# Altium project ECGAcquisitionSystem.PrjPcb
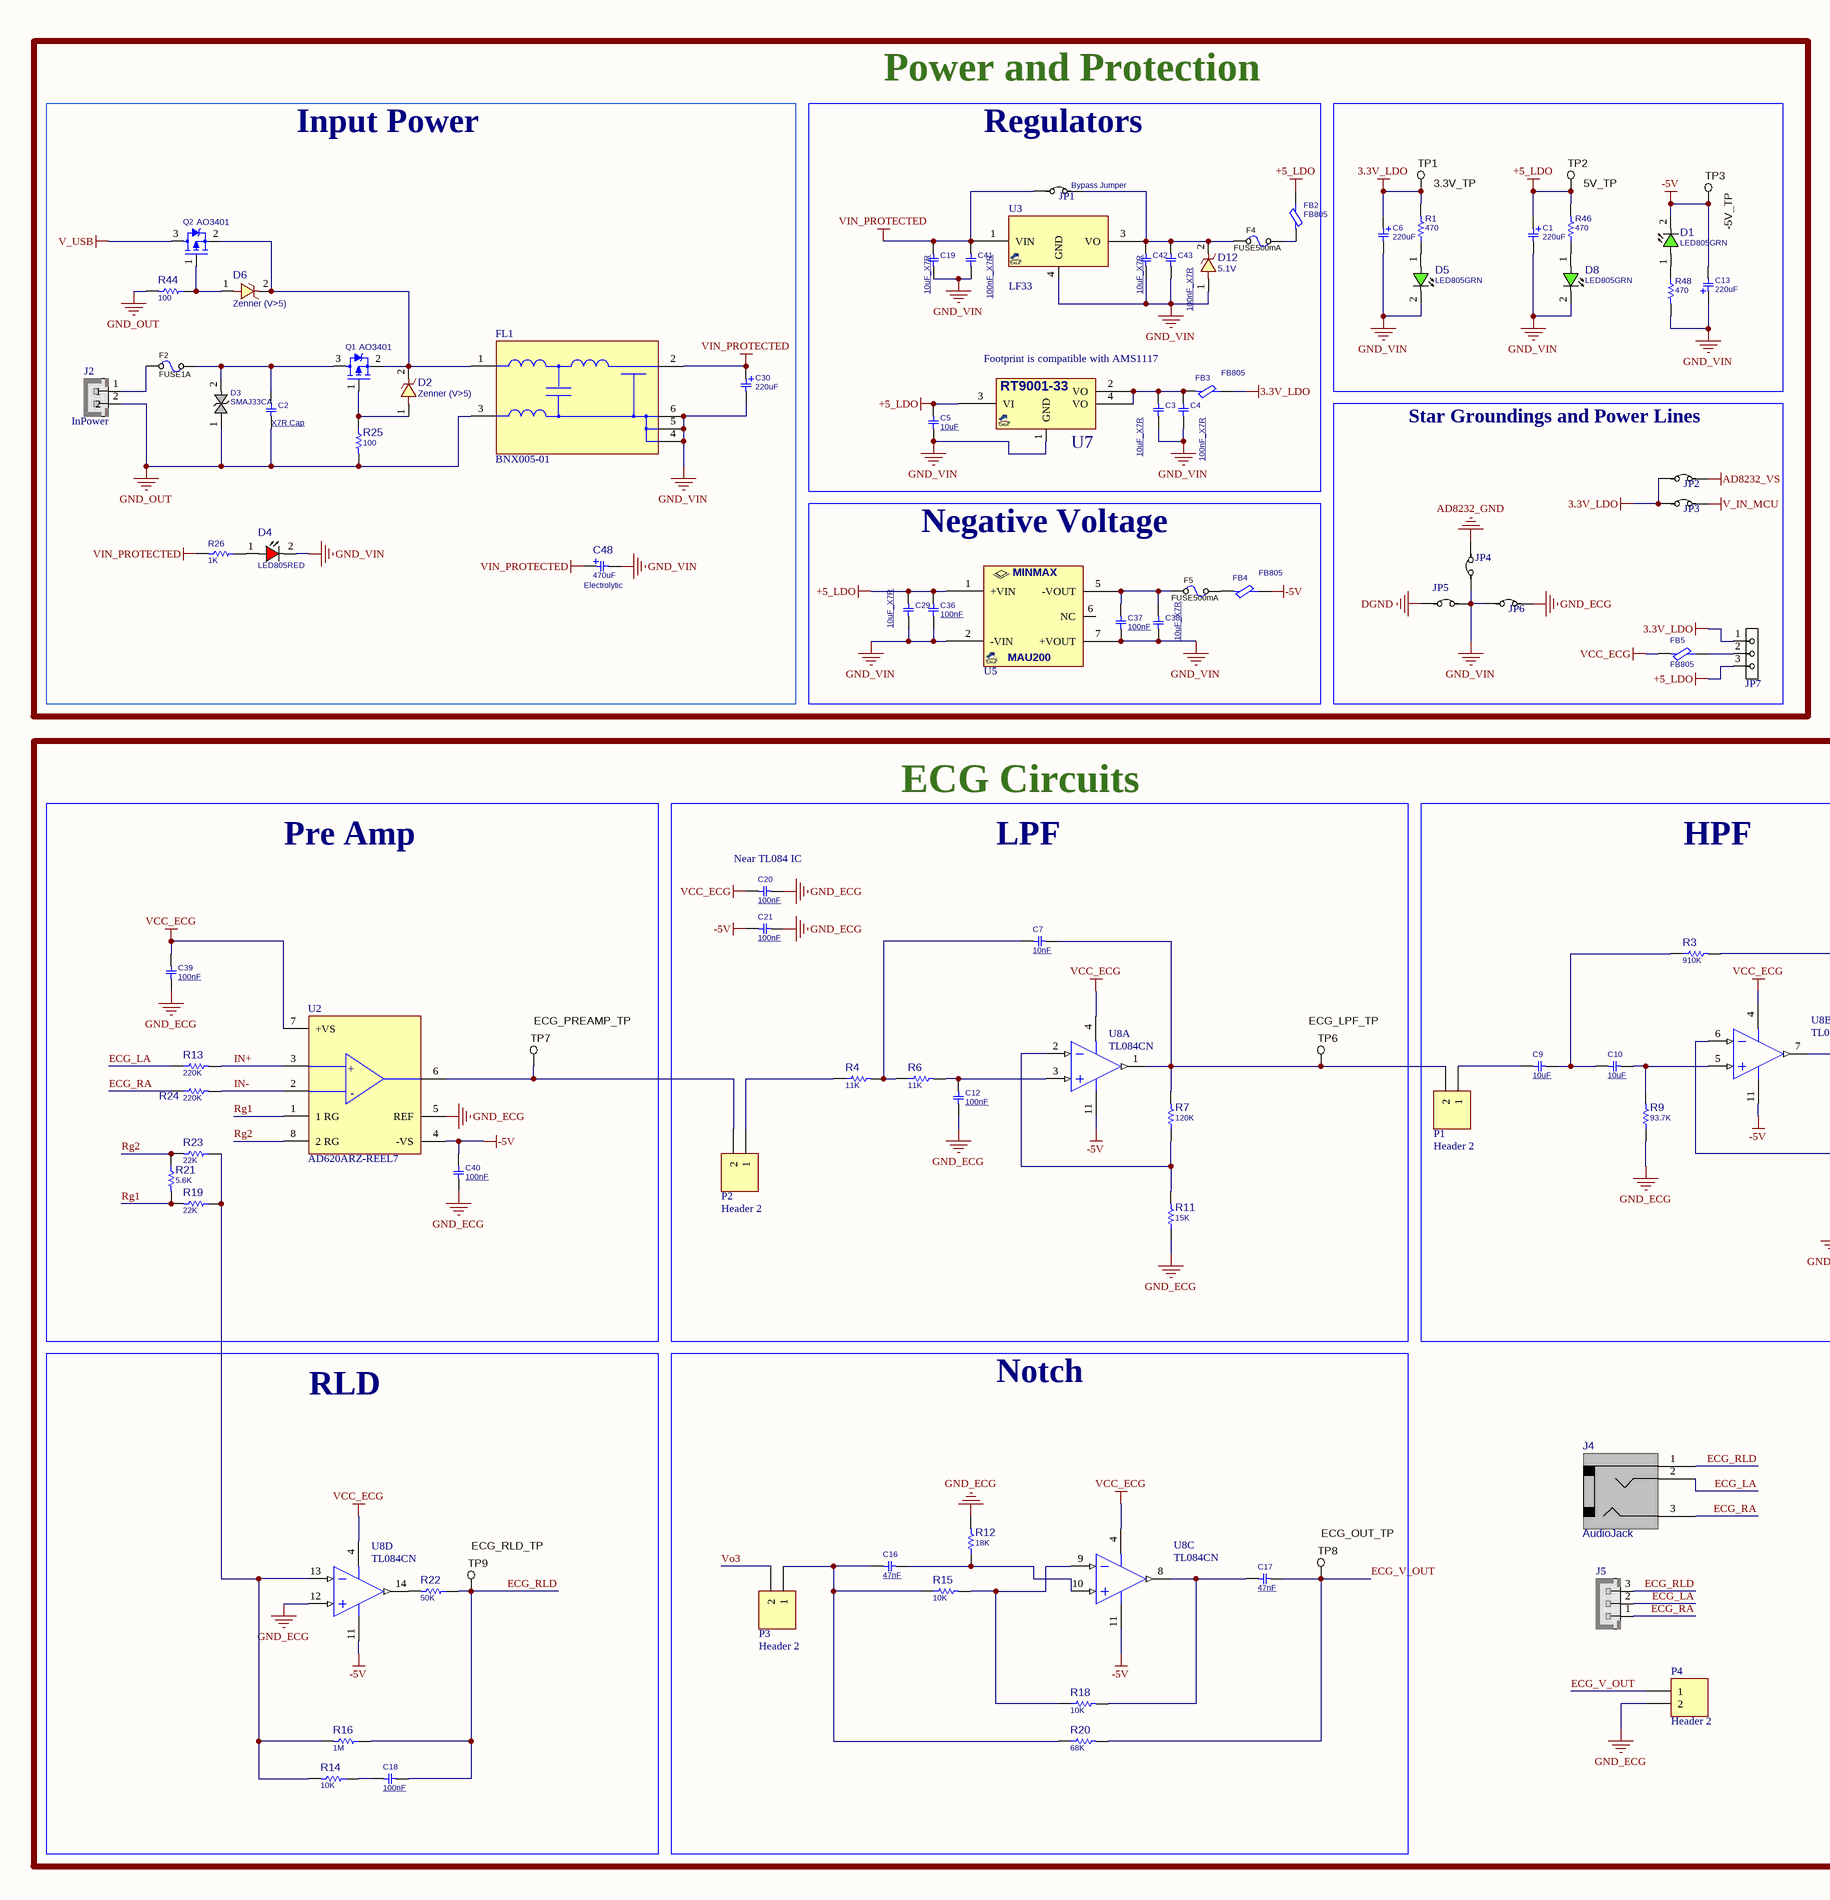
[diagram p0: Sch_ECGAcquisitionSystem.SchDoc, left]
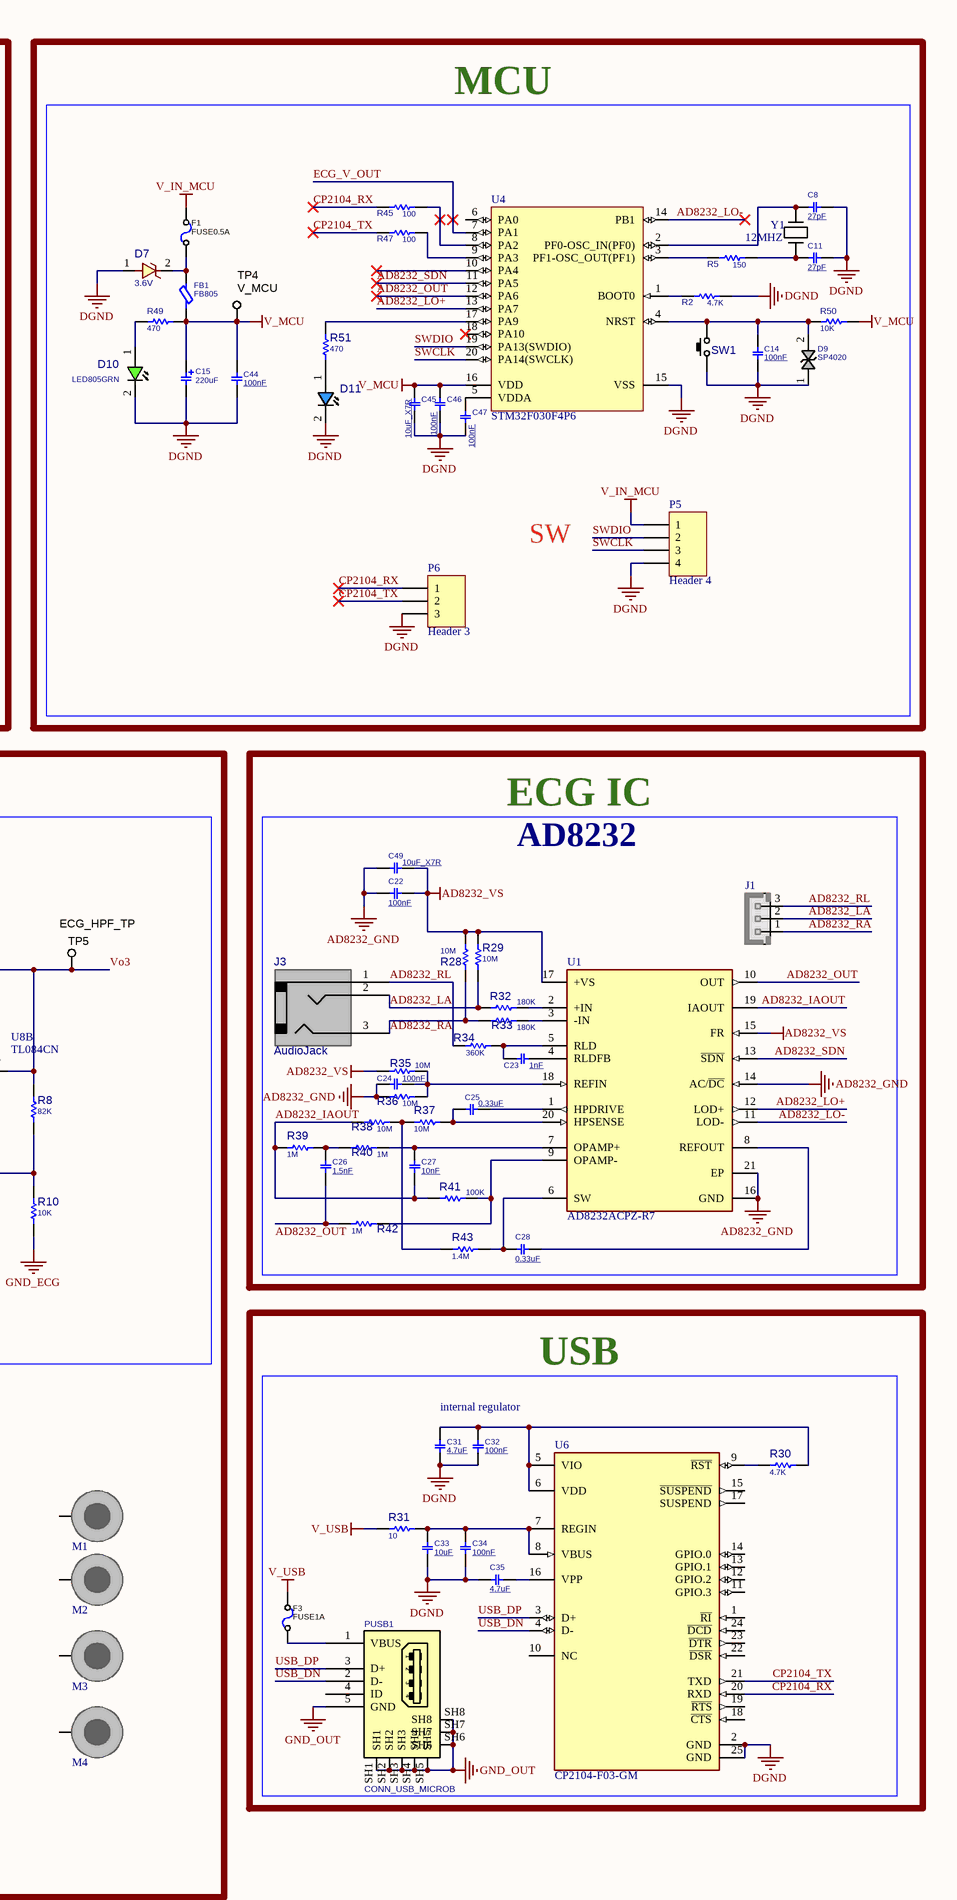
[diagram p1: Sch_ECGAcquisitionSystem.SchDoc, right]
1 sheet, 165 parts. Net scope: global (net labels, ports and power ports of the same name join across sheets).
Board file: PCB_ECGAcquisitionSystem.PcbDoc

## Sheet Sch_ECGAcquisitionSystem.SchDoc: ECG Acquisition Board
size A2; Date: Jan 2024; Engineer: Ali Hashemi; Revision: 1; SheetNumber: 1; SheetTotal: 1

### Parts
C1  220uF  [C_TN_7343]
C2  X7R Cap  [C0805S]
C3  10uF_X7R  [C0805S]
C4  100nF_X7R  [C0805S]
C5  10uF  [C0805S]
C6  220uF  [C_TN_7343]
C7  10nF  [C0805S]
C8  27pF  [C0805]
C9  10uF  [C0805S]
C10  10uF  [C0805S]
C11  27pF  [C0805]
C12  100nF  [C0805S]
C13  220uF  [C_TN_7343]
C14  100nF  [C0805S]
C15  220uF  [C_TN_7343]
C16  47nF  [C0805S]
C17  47nF  [C0805S]
C18  100nF  [C0805S]
C19  10uF_X7R  [C0805S]
C20  100nF  [C0805S]
C21  100nF  [C0805S]
C22  100nF  [C0805]
C23  1nF  [C0805]
C24  100nF  [C0805]
C25  0.33uF  [C0805]
C26  1.5nF  [C0805]
C27  10nF  [C0805]
C28  0.33uF  [C0805]
C29  10uF_X7R  [C0805S]
C30  220uF  [C_TN_7343]
C31  4.7uF  [C0805]
C32  100nF  [C0805]
C33  10uF  [C0805]
C34  100nF  [C0805]
C35  4.7uF  [C0805]
C36  100nF  [C0805S]
C37  100nF  [C0805S]
C38  10uF_X7R  [C0805S]
C39  100nF  [C0805S]
C40  100nF  [C0805S]
C41  100nF_X7R  [C0805S]
C42  10uF_X7R  [C0805S]
C43  100nF_X7R  [C0805S]
C44  100nF  [C0805]
C45  10uF_X7R  [C0805S]
C46  100nF  [C0805]
C47  100nF  [C0805]
C48  Electrolytic  value 470uF  [C_EL_6_8]
C49  10uF_X7R  [C0805S]
D1  LED805GRN  [LED0805GRN]
D2  Zenner (V>5)  [D_SOD123W]
D3  SMAJ33CA  [D_SMA]
D4  LED805RED  [LED0805RED]
D5  LED805GRN  [LED0805GRN]
D6  Zenner (V>5)  [D_SOD123W]
D7  3.6V  [D_SOD123W]
D8  LED805GRN  [LED0805GRN]
D9  SP4020  [D_SOD323]
D10  LED805GRN  [LED0805GRN]
D11  (no value)  [LED0805BLU]
D12  5.1V  [D_SOD123W]
F1  FUSE0.5A  [F1206]
F2  FUSE1A  [F1206]
F3  FUSE1A  [F1206]
F4  FUSE500mA  [F0805]
F5  FUSE500mA  [F0805]
FB1  FB805  [L0805]
FB2  FB805  [L0805]
FB3  FB805  [L0805]
FB4  FB805  [L0805]
FB5  FB805  [L0805]
FL1  BNX005-01  [FP-BNX_L12MM5_W11MM5_T13M-MFG]
J1  HHDR_3  [XH_3]  (value not drawn)
J2  InPower  [XH_2]
J3  AudioJack  [JCKAS_STX3500]
J4  AudioJack  [JCKAS_STX3500]
J5  HHDR_3  [XH_3]  (value not drawn)
JP1  Bypass Jumper  [JP_40X50]
JP2  (no value)  [JP_40X50]
JP3  (no value)  [JP_40X50]
JP4  (no value)  [JP_40X50]
JP5  (no value)  [JP_40X50]
JP6  (no value)  [JP_40X50]
JP7  JMPHDR3PIN  [JP_3]  (value not drawn)
M1  DNP/MH  [SCMH_M3]  (value not drawn)  (no BOM)
M2  DNP/MH  [SCMH_M3]  (value not drawn)  (no BOM)
M3  DNP/MH  [SCMH_M3]  (value not drawn)  (no BOM)
M4  DNP/MH  [SCMH_M3]  (value not drawn)  (no BOM)
P1  Header 2  [HDR1X2]
P2  Header 2  [HDR1X2]
P3  Header 2  [HDR1X2]
P4  Header 2  [HDR1X2]
P5  Header 4  [HDR1X4]
P6  Header 3  [HDR1X3]
PUSB1  CONN_USB_MICROB  [USB_MICRO_B_BM_SHS]
Q1  AO3401  [SOT23_3]
Q2  AO3401  [SOT23_3]
R1  470  [R0805S]
R2  4.7K  [R0805S]
R3  910K  [R0805]
R4  11K  [R0805]
R5  150  [R0805S]
R6  11K  [R0805]
R7  120K  [R0805]
R8  82K  [R0805]
R9  93.7K  [R0805]
R10  10K  [R0805]
R11  15K  [R0805]
R12  18K  [R0805]
R13  220K  [R0805]
R14  10K  [R0805]
R15  10K  [R0805]
R16  1M  [R0805]
R18  10K  [R0805]
R19  22K  [R0805]
R20  68K  [R0805]
R21  5.6K  [R0805]
R22  50K  [R0805]
R23  22K  [R0805]
R24  220K  [R0805]
R25  100  [R0805S]
R26  1K  [R0805S]
R28  10M  [R0805]
R29  10M  [R0805]
R30  4.7K  [R0805]
R31  10  [R0805]
R32  180K  [R0805]
R33  180K  [R0805]
R34  360K  [R0805]
R35  10M  [R0805]
R36  10M  [R0805]
R37  10M  [R0805]
R38  10M  [R0805]
R39  1M  [R0805]
R40  1M  [R0805]
R41  100K  [R0805]
R42  1M  [R0805]
R43  1.4M  [R0805]
R44  100  [R0805S]
R45  100  [R0805S]
R46  470  [R0805S]
R47  100  [R0805S]
R48  470  [R0805S]
R49  470  [R0805S]
R50  10K  [R0805S]
R51  470  [R0805S]
SW1  PUSHBUTTON  [SWPBS_SPST_6X3X5]  (value not drawn)
TP1  3.3V_TP  [TPTHD_C_BLK2]  (no BOM)
TP2  5V_TP  [TPTHD_C_BLK2]  (no BOM)
TP3  -5V_TP  [TPTHD_C_BLK2]  (no BOM)
TP4  V_MCU  [TPSMD_S1]  (no BOM)
TP5  ECG_HPF_TP  [TPTHD_C_BLK2]  (no BOM)
TP6  ECG_LPF_TP  [TPTHD_C_BLK2]  (no BOM)
TP7  ECG_PREAMP_TP  [TPTHD_C_BLK2]  (no BOM)
TP8  ECG_OUT_TP  [TPTHD_C_BLK2]  (no BOM)
TP9  ECG_RLD_TP  [TPTHD_C_BLK2]  (no BOM)
U1  AD8232ACPZ-R7  [FP-CP-20-8-IPC_C]
U2  AD620ARZ-REEL7  [FP-R-8-IPC_B]
U3  LF33  [DPAK_3]
U4  STM32F030F4P6  [STM-TSSOP20_L]
U5  MAU202  [MINMAX_MAU200]  (value not drawn)
U6  CP2104-F03-GM  [FP-CP2104-F03-GM-MFG]
U7  RT9001-33  [SOT223_4]  (value not drawn)
U8  TL084CN  [N0014A]  (parts A,B,C,D of 4)
Y1  12MHZ  [XTL_2_11X5]

### Blocks framed on the sheet
Regulators: C1 C6 C13 D1 D5 D8 R1 R46 R48 TP1-TP3
Input Power: C2 C30 C48 D2-D4 D6 F2 FL1 J2 Q1 Q2 R25 R26 R44
Power and Protection: C3-C5 C19 C41-C43 D12 F4 FB2 FB3 JP1 U3 U7
SW: C8 C11 C14 C15 C44-C47 D7 D9-D11 F1 FB1 P5 P6 R2 R5 R45 R47 R49-R51 SW1 TP4 U4 Y1
Star Groundings and Power Lines: FB5 JP2-JP7
Negative Voltage: C29 C36-C38 F5 FB4 U5
ECG Circuits: J4 J5 M1-M4 P4
Pre Amp: C39 C40 R13 R19 R21 R23 R24 TP7 U2
LPF: C7 C12 C20 C21 P2 R4 R6 R7 R11 TP6 U8
HPF: C9 C10 P1 R3 R8-R10 TP5 U8
AD8232: C22-C28 C49 J1 J3 R28 R29 R32-R43 U1
RLD: C18 R14 R16 R22 TP9 U8
Notch: C16 C17 P3 R12 R15 R18 R20 TP8 U8
internal regulator: C31-C35 F3 PUSB1 R30 R31 U6

### Nets
3.3V_LDO: C6.1 FB3.2 JP2.1 JP3.1 JP7.1 R1.2 TP1.1
+5_LDO: C1.1 C5.2 C29.2 C36.2 FB2.2 JP7.3 R46.2 TP2.1 U5.1(+VIN) U7.3(VI)
-5V: C13.2 C21.2 C40.1 D1.2(CATHODE) FB4.2 TP3.1 U2.4(-VS) U8.11(VCC-)
AD8232_GND: C22.1 C24.2 C49.2 JP4.2 R36.2 U1.14(AC/~{DC}) U1.16(GND) U1.21(EP)
AD8232_VS: C22.2 C49.1 JP2.2 R28.1 R29.1 R35.2 U1.15(FR) U1.17(+VS)
DGND: C8.2 C11.2 C14.2 C15.2 C31.1 C32.1 C33.1 C34.1 C35.1 C44.2 C45.1 C46.2 C47.2 D7.1 D9.1 D10.2(CATHODE) D11.2(CATHODE) JP5.1 P5.4 P6.3 R2.2 SW1.1(P1) U4.15(VSS) U6.2(GND) U6.25(GND)
GND_ECG: C12.2 C20.1 C21.1 C39.1 C40.2 JP6.2 P4.2 R9.1 R10.1 R11.1 R12.2 U2.5(REF) U8.12(IN4+)
GND_OUT: C2.2 D3.1 FL1.3(PSG) J2.2 PUSB1.5(GND) PUSB1.SH1 PUSB1.SH2 PUSB1.SH3 PUSB1.SH4 PUSB1.SH5 PUSB1.SH6 PUSB1.SH7 PUSB1.SH8 R25.2 R44.2
GND_VIN: C1.2 C3.1 C4.1 C5.1 C6.2 C13.1 C19.1 C29.1 C30.2 C36.1 C37.1 C38.2 C41.1 C42.1 C43.1 C48.2 D4.2(CATHODE) D5.2(CATHODE) D8.2(CATHODE) D12.1 FL1.4(CG) FL1.5(CG) FL1.6(CG) JP4.1 JP5.2 JP6.1 R48.2 U3.4(GND) U5.2(-VIN) U5.7(+VOUT) U7.1(GND)
V_IN_MCU: F1.2 JP3.2 P5.1
V_MCU: C15.1 C44.1 C45.2 C46.1 FB1.2 R49.2 R50.1 TP4.1 U4.16(VDD)
V_USB: F3.2 Q2.3(D) R31.2
VCC_ECG: C20.2 C39.2 FB5.1 U2.7(+VS) U8.4(VCC+)
VIN_PROTECTED: C19.2 C30.1 C41.2 C48.1 FL1.2(CB) JP1.1 R26.2 U3.1(VIN)
AD8232_IAOUT: C27.2 R38.1 R39.1 R41.1 U1.19(IAOUT)
AD8232_LA: J1.2 J3.2(TIP) R29.2 R32.2
AD8232_LO+: U1.12(LOD+) U4.13(PA7)
AD8232_LO-: U1.11(LOD-) U4.14(PB1)
AD8232_OUT: C26.2 R42.1 U1.10(OUT) U4.12(PA6)
AD8232_RA: J1.1 J3.3(RING) R28.2 R33.2
AD8232_RL: J1.3 J3.1(SHIELD) R34.2
AD8232_SDN: U1.13(~{SDN}) U4.11(PA5)
CP2104_RX: P6.1 R45.1 U6.20(RXD)
CP2104_TX: P6.2 R47.1 U6.21(TXD)
ECG_LA: J4.2(TIP) J5.2 R13.1
ECG_RA: J4.3(RING) J5.1 R24.1
ECG_RLD: C18.1 J4.1(SHIELD) J5.3 R16.1 R22.1 TP9.1
ECG_V_OUT: C17.1 P4.1 R20.2 TP8.1 U4.7(PA1)
IN+: R13.2 U2.3(+IN)
IN-: R24.2 U2.2(-IN)
Rg1: R19.2 R21.2 U2.1(1_RG)
Rg2: R21.1 R23.2 U2.8(2_RG)
SWCLK: P5.3 U4.20(PA14(SWCLK))
SWDIO: P5.2 U4.19(PA13(SWDIO))
USB_DN: PUSB1.2(D-) U6.4(D-)
USB_DP: PUSB1.3(D+) U6.3(D+)
Vo3: P3.2 R3.2 R8.2 TP5.1 U8.7(OUT2)
NetC2_1: C2.1 D3.2 F2.2 Q1.3(D)
NetC3_2: C3.2 C4.2 FB3.1 U7.2(VO) U7.4(VO)
NetC7_1: C7.1 P1.2 R7.2 TP6.1 U8.1(OUT1)
NetC7_2: C7.2 R4.2 R6.1
NetC8_1: C8.1 U4.2(PF0-OSC_IN(PF0)) Y1.1
NetC9_1: C9.1 C10.2 R3.1
NetC9_2: C9.2 P1.1
NetC10_1: C10.1 R9.2 U8.5(IN2+)
NetC11_1: C11.1 R5.2 Y1.2
NetC12_1: C12.1 R6.2 U8.3(IN1+)
NetC14_1: C14.1 D9.2 R50.2 SW1.2(P3) U4.4(NRST)
NetC16_1: C16.1 R12.1 U8.10(IN3+)
NetC16_2: C16.2 P3.1 R15.1 R20.1
NetC17_2: C17.2 R18.2 U8.8(OUT3)
NetC18_2: C18.2 R14.1
NetC23_1: C23.1 R34.1 U1.5(RLD)
NetC23_2: C23.2 U1.4(RLDFB)
NetC24_1: C24.1 R35.1 R36.1 U1.18(REFIN)
NetC25_1: C25.1 U1.1(HPDRIVE)
NetC25_2: C25.2 R37.1 U1.20(HPSENSE)
NetC26_1: C26.1 R39.2 R40.1
NetC27_1: C27.1 R40.2 U1.7(OPAMP+)
NetC28_1: C28.1 R43.1 U1.6(SW)
NetC28_2: C28.2 U1.8(REFOUT)
NetC31_2: C31.2 C32.2 R30.1 U6.5(VIO) U6.6(VDD)
NetC33_2: C33.2 C34.2 R31.1 U6.7(REGIN) U6.8(VBUS)
NetC35_2: C35.2 U6.16(VPP)
NetC37_2: C37.2 C38.1 F5.1 U5.5(-VOUT)
NetC42_2: C42.2 C43.2 D12.2 F4.1 JP1.2 U3.3(VO)
NetC47_1: C47.1 U4.5(VDDA)
NetD1_1: D1.1(ANODE) R48.1
NetD2_1: D2.1 Q1.1(G) R25.1
NetD2_2: D2.2 D6.2 FL1.1(B) Q1.2(S) Q2.2(S)
NetD4_1: D4.1(ANODE) R26.1
NetD5_1: D5.1(ANODE) R1.1
NetD6_1: D6.1 Q2.1(G) R44.1
NetD7_2: D7.2 F1.1 FB1.1
NetD8_1: D8.1(ANODE) R46.1
NetD10_1: D10.1(ANODE) R49.1
NetD11_1: D11.1(ANODE) R51.1
NetF2_1: F2.1 J2.1
NetF3_1: F3.1 PUSB1.1(VBUS)
NetF4_2: F4.2 FB2.1
NetF5_2: F5.2 FB4.1
NetFB5_2: FB5.2 JP7.2
NetP2_1: P2.1 R4.1
NetP2_2: P2.2 TP7.1 U2.6(OUTPUT)
NetR2_1: R2.1 U4.1(BOOT0)
NetR5_1: R5.1 U4.3(PF1-OSC_OUT(PF1))
NetR7_1: R7.1 R11.2 U8.2(IN1-)
NetR8_1: R8.1 R10.2 U8.6(IN2-)
NetR14_2: R14.2 R16.2 R19.1 R23.1 U8.13(IN4-)
NetR15_2: R15.2 R18.1 U8.9(IN3-)
NetR22_2: R22.2 U8.14(OUT4)
NetR30_2: R30.2 U6.9(~{RST})
NetR32_1: R32.1 U1.2(+IN)
NetR33_1: R33.1 U1.3(-IN)
NetR37_2: R37.2 R38.2 R43.2
NetR41_2: R41.2 R42.2 U1.9(OPAMP-)
NetR45_2: R45.2 U4.8(PA2)
NetR47_2: R47.2 U4.9(PA3)
NetR51_2: R51.2 U4.17(PA9)

Not connected (* = marked no-connect by the designer): M1 1; M2 1; M3 1; M4 1; PUSB1 4(ID); U4 6(PA0) 10(PA4)* 18(PA10)*; U5 6(NC); U6 1(~{RI}) 10(NC) 11(GPIO.3) 12(GPIO.2) 13(GPIO.1) 14(GPIO.0) 15(~{SUSPEND}) 17(SUSPEND) 18(~{CTS}) 19(~{RTS}) 22(~{DSR}) 23(~{DTR}) 24(~{DCD})

### Notes on the sheet
- MCU
- Footprint is compatible with AMS1117
- ECG IC
- (near C20) Near TL084 IC
- USB
- (in symbol CMP-09116-000354-1) +
- (in symbol MAU202) MAU200

### Library data of the parts
C1 C6 C13 C15 C30 = CAP_SMD_TAN_220uF: CAP, SMD, TAN; PARAM: 20%, 35mOhm, -55~105oC; MANF: VISHAY; MANF_P#: T55D227M6R3C0035; PARAM2: 6.3V; PRICE: 1.9$; VALUE: 220uF
  C1 C6 C13 C30: ClassName: Power
  C15: ClassName: MCU_COMPONENTS
C2-C5 C7-C12 C14 C16-C29 C31-C47 C49 = CAP_SMD_MLCC_0805: CAP, MLCC, -F, -V, MATERIAL, -%, 0201; PARAM: -, -%; MANF_P#: MANF_PART#; PRICE: 100= 1$; MANF: -; PARAM2: -V; ASSEMBLY: ASSEMBLY
  C2: VALUE: X7R Cap; ClassName: Power
  C3 C19 C29 C38 C42: VALUE: 10uF_X7R; ClassName: Power
  C4 C41 C43: VALUE: 100nF_X7R; ClassName: Power
  C5: VALUE: 10uF; ClassName: Power
  C7: VALUE: 10nF; ClassName: ECG_CIRCUIT
  C8 C11: VALUE: 27pF; ClassName: MCU_COMPONENTS
  C9 C10: VALUE: 10uF; ClassName: ECG_CIRCUIT
  C12 C18 C20 C21 C39 C40: VALUE: 100nF; ClassName: ECG_CIRCUIT
  C14 C44 C46 C47: VALUE: 100nF; ClassName: MCU_COMPONENTS
  C16 C17: VALUE: 47nF; ClassName: ECG_CIRCUIT
  C22 C24: VALUE: 100nF; ClassName: AD8232_COMPONENTS
  C23: VALUE: 1nF; ClassName: AD8232_COMPONENTS
  C25 C28: VALUE: 0.33uF; ClassName: AD8232_COMPONENTS
  C26: VALUE: 1.5nF; ClassName: AD8232_COMPONENTS
  C27: VALUE: 10nF; ClassName: AD8232_COMPONENTS
  C31 C35: VALUE: 4.7uF; ClassName: USB_COMPONENTS
  C32 C34: VALUE: 100nF; ClassName: USB_COMPONENTS
  C33: VALUE: 10uF; ClassName: USB_COMPONENTS
  C36 C37: VALUE: 100nF; ClassName: Power
  C45: VALUE: 10uF_X7R; ClassName: MCU_COMPONENTS
  C49: VALUE: 10uF_X7R; ClassName: AD8232_COMPONENTS
C48 = CAP_SMD_EL_180u16V: CAP, SMD, ELEC,; MANF_P#: 16SVPE180M; PARAM2: 16V; MANF: Panasonic; DESC: Aluminum Organic Polymer; DIST#: MOUSER; PARAM: 20%, 11mOhmESR, -55~105oC; PRICE: 0.8$; ASSEMBLY: ASSEMBLY; ClassName: Power
D1 D5 D8 D10 = LED_SMD_0805_GRN: LED, SMD, 0805, GREEN; PARAM: 20mA; DESC: DESCRIPTION; PARAM2: 2.2V; MANF: -; ASSEMBLY: ASSEMBLY; PRICE: 36t@Javan; MANF_P#: -; VALUE: LED805GRN
  D1 D5 D8: ClassName: Power
  D10: ClassName: MCU_COMPONENTS
D2 D6 D7 D12 = DIODE_SMD_ZENER_BZT52HC5V1: DIODE, ZENER, 1W, 5.1V; MANF: Diodes; DESC: DESCRIPTION; PARAM2: 1W, 4Ohm, -55~150oC; MANF_P#: BZT52HC5V1WF-7; ASSEMBLY: ASSEMBLY; PRICE: 0.25$; PARAM: 5.1V
  D2 D6: VALUE: Zenner (V>5); ClassName: Power
  D7: VALUE: 3.6V; ClassName: MCU_COMPONENTS
  D12: VALUE: 5.1V; ClassName: Power
D3 = TVS_SMAJ12CA: TVS, ESD PROTECT, Bidirectional; MANF: Littelfuse; PARAM2: 12VR, 13.3VBR; PARAM: -65~150°C; MANF_P#: SMAJ12CA; VALUE: SMAJ33CA; ClassName: Power
D4 = LED_SMD_0805_RED: LED, SMD, 0805, RED; DESC: DESCRIPTION; MANF_P#: MANF_PART#; PARAM2: 2.2V; MANF: MANF; ASSEMBLY: ASSEMBLY; PRICE: 36t@Javan; VALUE: LED805RED; ClassName: Power
D9 = TVS_PESD1IVN27: TVS, ESD PROTECT,; MANF_P#: PESD1IVN27-AX; MANF: NXP; PARAM: 27VRWM; VALUE: SP4020; ClassName: MCU_COMPONENTS
D11 = LED_SMD_0805_BLU: LED, SMD, 0805, BLUE; DESC: DESCRIPTION; MANF_P#: MANF_PART#; PARAM2: 2.2V; MANF: MANF; ASSEMBLY: ASSEMBLY; PRICE: 36t@Javan; ClassName: MCU_COMPONENTS
F1-F3 = FUSE_160mA_1206: Fuse, 160mA, 63VDC, 1206, SMD, Fast Acting; PARAM: 160mA; 63VDC; slow-blow; MANF: Holly Fuse; MANF_P#: 12T-0160L; PARAM2: PARAM2
  F1: VALUE: FUSE0.5A; ClassName: MCU_COMPONENTS
  F2 F3: VALUE: FUSE1A; ClassName: Power
F4 F5 = FUSE_500mA_0805_FAST: Fuse, 500mA, 32VDC, 0805, SMD, Fast Acting; PARAM: 500mA; 32VDC; fast acting; MANF_P#: MANF_PART#; PARAM2: 0.25 Ohm DC Cold Resistance; MANF: MANF; VALUE: FUSE500mA
FB1-FB5 = FBEAD_SMD_BLM21PG221: FERRITE_Bead, 0805, 2A, 50mOhm, 220@100MHz; MANF: MURATA; MANF_P#: BLM15AG121SN1D; PARAM: 220@100MHz; PARAM2: 2A, 50mOhm; VALUE: FB805; ClassName: MCU_COMPONENTS
FL1 = CMP-06051-000064-1: FILTER LC TH; Max Current Rating: 15A; Voltage Rating: 50V; Number of Channels: 2; Attenuation Value: 40dB; Frequency: 1GHz; Impedance: 50R; Shielding: Unshielded; ESD Protection: No; Height: 13.5mm; Circuit Type: Filter; Package Quantity: 100; Radiation Hardening: No; Max Operating Temperature: 85°C; Packaging: Bulk; Current Rating: 15A; Width: 11mm; REACH SVHC: No SVHC; Mount: Through Hole; Depth: 11mm; Termination: PC Pins; Current: 15A; Contact Plating: Copper; Min Operating Temperature: -30°C; Max Voltage Rating (DC): 50V; Length: 12mm; Lead Free: Lead Free; ClassName: Power
J1 J5 = XH_3: JST-XH pitch: 2.5mm; VALUE: HHDR_3
  J1: ClassName: AD8232_COMPONENTS
  J5: ClassName: ECG_CIRCUIT
J2 = XH_2: JST-XH pitch: 2.5mm; VALUE: HHDR_2
J3 J4 = JACKA3.5SMD_STX-3500-3: Jack, Audio, Stereo, 3.5mm, RA, SMD; MANF: Kycon; DESC: DESCRIPTION; DIST#: MOUSER; MANF_P#: STX-3500-3NTR; ASSEMBLY: ASSEMBLY; PARAM: PARAM; PRICE: 1.6$; VALUE: AudioJack
  J3: ClassName: AD8232_COMPONENTS
  J4: ClassName: ECG_CIRCUIT
JP1-JP6 = JUMPER_SOLDER: JUMPER, HEADER 2PIN; MANF: MANF; MANF_P#: MANF_P#; ClassName: Power
  JP1: VALUE: Bypass Jumper
JP7 = JUMPER_HDR_3P: JUMPER, HEADER 3PIN; MANF: MANF; MANF_P#: MANF_P#; VALUE: JMPHDR3PIN; ClassName: Power
M1-M4 = SCMH_M3: SCREW mouting, M3, 3.0mm diameter and 6.0mm PanHead; ASSEMBLY: DNP; VALUE: DNP/MH
P1-P4 = Header 2: Header, 2-Pin; LatestRevisionDate: 17-Jul-2002; LatestRevisionNote: Re-released for DXP Platform.; Publisher: Altium Limited; ClassName: ECG_CIRCUIT
P5 = Header 4: Header, 4-Pin; LatestRevisionDate: 17-Jul-2002; LatestRevisionNote: Re-released for DXP Platform.; Publisher: Altium Limited
P6 = Header 3: Header, 3-Pin; LatestRevisionDate: 17-Jul-2002; LatestRevisionNote: Re-released for DXP Platform.; Publisher: Altium Limited
PUSB1 = CONN_USB_MICRO_B_BM_SHS: CONN, USB, MICRO B, R/A, SMD, BOTTOM MOUNT; MANF_P#: 47346-0001; MANF: Molex; MANF_P#2: HIROSE ZX62-AB-5PA; PARAM2: 30VAC; PARAM: 1.8A, -20~85oC; PRICE: 0.75$; VALUE: CONN_USB_MICROB; ClassName: USB_COMPONENTS
Q1 Q2 = MOSP_AO3401_SOT23: MOSFET P-CH AO3401 SMD SOT-23 3P; PARAM: 4.2A/30V; MANF: ALPHA & OMEGA; ASSEMBLY: ASSEMBLY; MANF_P#: AO3401; VALUE: AO3401; ClassName: Power
R1 R2 R5 R25 R26 R44-R51 = RES_SMD: RESISTOR, SMD; PARAM: -W; DESC: DESCRIPTION; DIST#: MOUSER; PARAM2: 1%; MANF_P#: -; MANF: -; ASSEMBLY: ASSEMBLY; PRICE: 100= 0.5$
  R1 R46 R48: VALUE: 470; ClassName: Power
  R2: VALUE: 4.7K; ClassName: MCU_COMPONENTS
  R5: VALUE: 150; ClassName: MCU_COMPONENTS
  R25 R44: VALUE: 100; ClassName: Power
  R26: VALUE: 1K; ClassName: Power
  R45 R47: VALUE: 100; ClassName: MCU_COMPONENTS
  R49 R51: VALUE: 470; ClassName: MCU_COMPONENTS
  R50: VALUE: 10K; ClassName: MCU_COMPONENTS
R3 R4 R6-R16 R18-R24 R28-R43 = RES_SMD_0805: RESISTOR, SMD; PARAM: -W; DESC: DESCRIPTION; DIST#: MOUSER; PARAM2: 1%; MANF_P#: -; MANF: -; ASSEMBLY: ASSEMBLY; PRICE: 100= 0.5$
  R3: VALUE: 910K; ClassName: ECG_CIRCUIT
  R4 R6: VALUE: 11K; ClassName: ECG_CIRCUIT
  R7: VALUE: 120K; ClassName: ECG_CIRCUIT
  R8: VALUE: 82K; ClassName: ECG_CIRCUIT
  R9: VALUE: 93.7K; ClassName: ECG_CIRCUIT
  R10 R14 R15 R18: VALUE: 10K; ClassName: ECG_CIRCUIT
  R11: VALUE: 15K; ClassName: ECG_CIRCUIT
  R12: VALUE: 18K; ClassName: ECG_CIRCUIT
  R13 R24: VALUE: 220K; ClassName: ECG_CIRCUIT
  R16: VALUE: 1M; ClassName: ECG_CIRCUIT
  R19 R23: VALUE: 22K; ClassName: ECG_CIRCUIT
  R20: VALUE: 68K; ClassName: ECG_CIRCUIT
  R21: VALUE: 5.6K; ClassName: ECG_CIRCUIT
  R22: VALUE: 50K; ClassName: ECG_CIRCUIT
  R28 R29 R35-R38: VALUE: 10M; ClassName: AD8232_COMPONENTS
  R30: VALUE: 4.7K; ClassName: USB_COMPONENTS
  R31: VALUE: 10; ClassName: USB_COMPONENTS
  R32 R33: VALUE: 180K; ClassName: AD8232_COMPONENTS
  R34: VALUE: 360K; ClassName: AD8232_COMPONENTS
  R39 R40 R42: VALUE: 1M; ClassName: AD8232_COMPONENTS
  R41: VALUE: 100K; ClassName: AD8232_COMPONENTS
  R43: VALUE: 1.4M; ClassName: AD8232_COMPONENTS
SW1 = SWPBS_SPST_6X3X4: SWITCH, PUSH BUTTON, TACTILE, SMD, SPST, 6X3.5X4.3mm; MANF: Panasonic; DESC: DESCRIPTION; MANF_P#: EVQ-PNF04M; VALUE: PUSHBUTTON; ASSEMBLY: ASSEMBLY; PARAM: PARAM; PRICE: PRICE; ClassName: MCU_COMPONENTS
TP1-TP3 TP5-TP9 = TESTPOINT_BIG_BLK2: TEST POINT; MANF: MANF; MANF_P#: MANF_P#; VALUE: VALUE
  TP1-TP3: ClassName: Power
  TP5-TP9: ClassName: ECG_CIRCUIT
TP4 = TESTPOINT_SMD: TEST POINT; MANF: MANF; MANF_P#: MANF_P#; VALUE: VALUE
U1 = CMP-09085-000003-1: IC ECG FRONT END 20LFCSP; Input Offset Voltage (Vos): 3mV; Power Supply Rejection Ratio (PSRR): 90dB; Input Bias Current: 50pA; Nominal Supply Current: 170uA; Min Supply Voltage: 2V; Common Mode Rejection Ratio: 80dB; Max Supply Voltage: 3.5V; Contact Plating: Tin; Operating Supply Current: 170uA; Packaging: Tape and Reel; REACH SVHC: No SVHC; Case/Package: LFCSP EP; Number of Pins: 20; Lead Free: Contains Lead; Min Operating Temperature: -40°C; Package Quantity: 1500; Mount: Surface Mount; Max Operating Temperature: 85°C; ClassName: AD8232_COMPONENTS
U2 = CMP-09116-000354-1: IC INST AMP 1 CIRCUIT 8SOIC; Input Resistance: 10GR; Bandwidth: 800kHz; Dual Supply Voltage: 15V; Number of Channels: 1; Power Dissipation: 650mW; Input Bias Current: 500pA; Common Mode Rejection Ratio: 93dB; Slew Rate: 1.2V/µs; Supply Current: 900uA; Input Offset Voltage (Vos): 30mV; Min Dual Supply Voltage: 2.3V; Min Supply Voltage: 4.6V; Power Supply Rejection Ratio (PSRR): 140dB; Operating Supply Voltage: 18V; Output Current per Channel: 18mA; -3db Bandwidth: 1MHz; Operating Supply Current: 1.3mA; Mount: Surface Mount; RoHS Compliant: Yes; Max Operating Temperature: 125°C; Radiation Hardening: No; Packaging: Tape and Reel; Nominal Supply Current: 900uA; Contact Plating: Tin; Number of Elements: 1; Number of Circuits: 1; Series: -; Case/Package: SOIC; Package Quantity: 1; Max Dual Supply Voltage: 18V; Min Operating Temperature: -55°C; Lead Free: Contains Lead; Number of Pins: 8; Max Power Dissipation: 650mW; ClassName: ECG_CIRCUIT
U3 = VREG_LFXX_TO252: REG, Linear, LDO0.45V, 0.5A, TO-252; MANF: ST; PARAM2: 1.5/1.8/2.5/3.3/5V; MANF_P#: LF33; PARAM: LDO0.45V, 0.5A; PRICE: 1500t; VALUE: LF33; ClassName: Power
U4 = CMP-0304-00039-2: ARM Cortex-M0 32-bit MCU, 16 KB Flash, 4 KB Internal RAM, 15 I/Os, 20-pin TSSOP, -40 to 85 degC, Tube; I/Os (High Current): 15; FLASH Size (Prog) (kB): 16; Internal RAM Size (kB): 4; Supply Voltage(Vcc) min (V): 2.4; Operating Frequency(F) (Processor speed) (MHz): 48; ComponentLink2URL: http://www.st.com/st-web-ui/static/active/en/resource/technical/document/datasheet/DM00088500.pdf; Core: ARM Cortex-M0; ComponentLink2Description: Datasheet; PackageDescription: 20-Pin Thin Shrink Small Outline Package, 6.5 x 4.4 mm Body, 0.65 mm Pitch; Mounting Technology: Surface Mount; ComponentLink1URL: http://www.st.com/web/en/home.html; PackageVersion: Rev. 1, 11/2012; ComponentLink3Description: Package Specification; PartNumber: STM32F030F4P6; ComponentLink3URL: http://www.st.com/st-web-ui/static/active/en/resource/technical/document/datasheet/DM00065136.pdf; DatasheetVersion: Rev. 1; PackageReference: TSSOP20; ComponentLink1Description: Manufacturer URL; Packing: Tube; ClassName: MCU_COMPONENTS
U5 = MAU202: DC-DC Converter, Isolated, 1W; MANF: MINMAX; PARAM2: 4.5~5.5(5)Vin, 5Vout, 1W; PARAM: 200mA, -40~85°C; DESC: https://www.minmax.com.tw/cn/download/files/228/MAU200_Datasheet.pdf; MANF_P#: MAU202; VALUE: MAU202; ClassName: Power
U6 = CMP-0511-00004-2: IC SGL USB-TO-UART BRIDGE 24QFN; Number of Transceivers: 1; Max Supply Voltage: 3.6V; Operating Supply Current: 17mA; Operating Supply Voltage: 3.3V; Data Rate: 2Mbps; Min Supply Voltage: 3V; Number of Channels: 1; Max Operating Temperature: 85°C; Contact Plating: Tin; Min Operating Temperature: -40°C; Number of Pins: 24; Case/Package: QFN; Packaging: Rail/Tube; Radiation Hardening: No; Weight: 0.001764oz; ClassName: USB_COMPONENTS
U7 = VREG_RT9001-33_SOT223: (Footprint is compatible with AMS1117) REG, Linear, LDO0.58V, 0.6A, 3.3V FIXED, SOT223; MANF_P#: RT9001-33GG; MANF: RICHTEK; PARAM2: LDO0.58V, 3~5.5VIN, 3.3Vout; PARAM: 0.6A, -55dBpsrr@1KHz, -40~125°C; PRICE: 1.7t@Lion; DESC: http://www.lionelectronic.ir/content/rt9001-33gg; VALUE: RT9001-33; ClassName: Power
U8 = CMP-0017-00818-2: JFET-Input Operational Amplifier, 7 to 36 V, 0 to 70 degC, 14-pin DIP (N14), Pb-Free (RoHS); Manufacturer: Texas Instruments; Rating: Catalog; Iq per channel(Max)(mA): 2.8; Number of Channels: 4; IIB(Max)(pA): 400; Vio (25C)(Max)(mV): 15; GBW(Typ)(MHz): 3; Total Supply Voltage(Max)(+5V is 5, +/-5V is 10): 36; Vn at 1kHz(Typ)(nV/rtHz): 18; Sub Family: General Purpose Amplifier, High Supply Voltage Amplifier (>=30V); Slew Rate(Typ)(V/us): 13; Total Supply Voltage(Min)(+5V is 5, +/-5V is 10): 7; CMRR(Min)(dB): 70; ComponentLink3Description: Package Specification; PackageDescription: 14-Pin Plastic In-Line, Body 19.305 x 6.35 mm, Pitch 2.54 mm; ComponentLink1Description: Manufacturer URL; PackageVersion: 4040049/E, 12/2002; Eco-Plan: Pb-Free (RoHS); ComponentLink2URL: http://www.ti.com/lit/ds/symlink/tl084.pdf; ComponentLink1URL: http://www.ti.com/; DatasheetVersion: SLOS081G; Mounting Technology: Through Hole; PartNumber: TL084CN; Offset Drift(Typ)(uV/C): 18; PackageReference: N0014A; ComponentLink3URL: http://www.ti.com/lit/ml/mpdi002c/mpdi002c.pdf; ComponentLink2Description: Datasheet; Code_JEDEC: MS-001; ClassName: ECG_CIRCUIT
Y1 = CRYSTAL-GENERIC: SMD CRYSTAL; ClassName: MCU_COMPONENTS